# Altium schematic sheet audio_radio.SchDoc
size A4
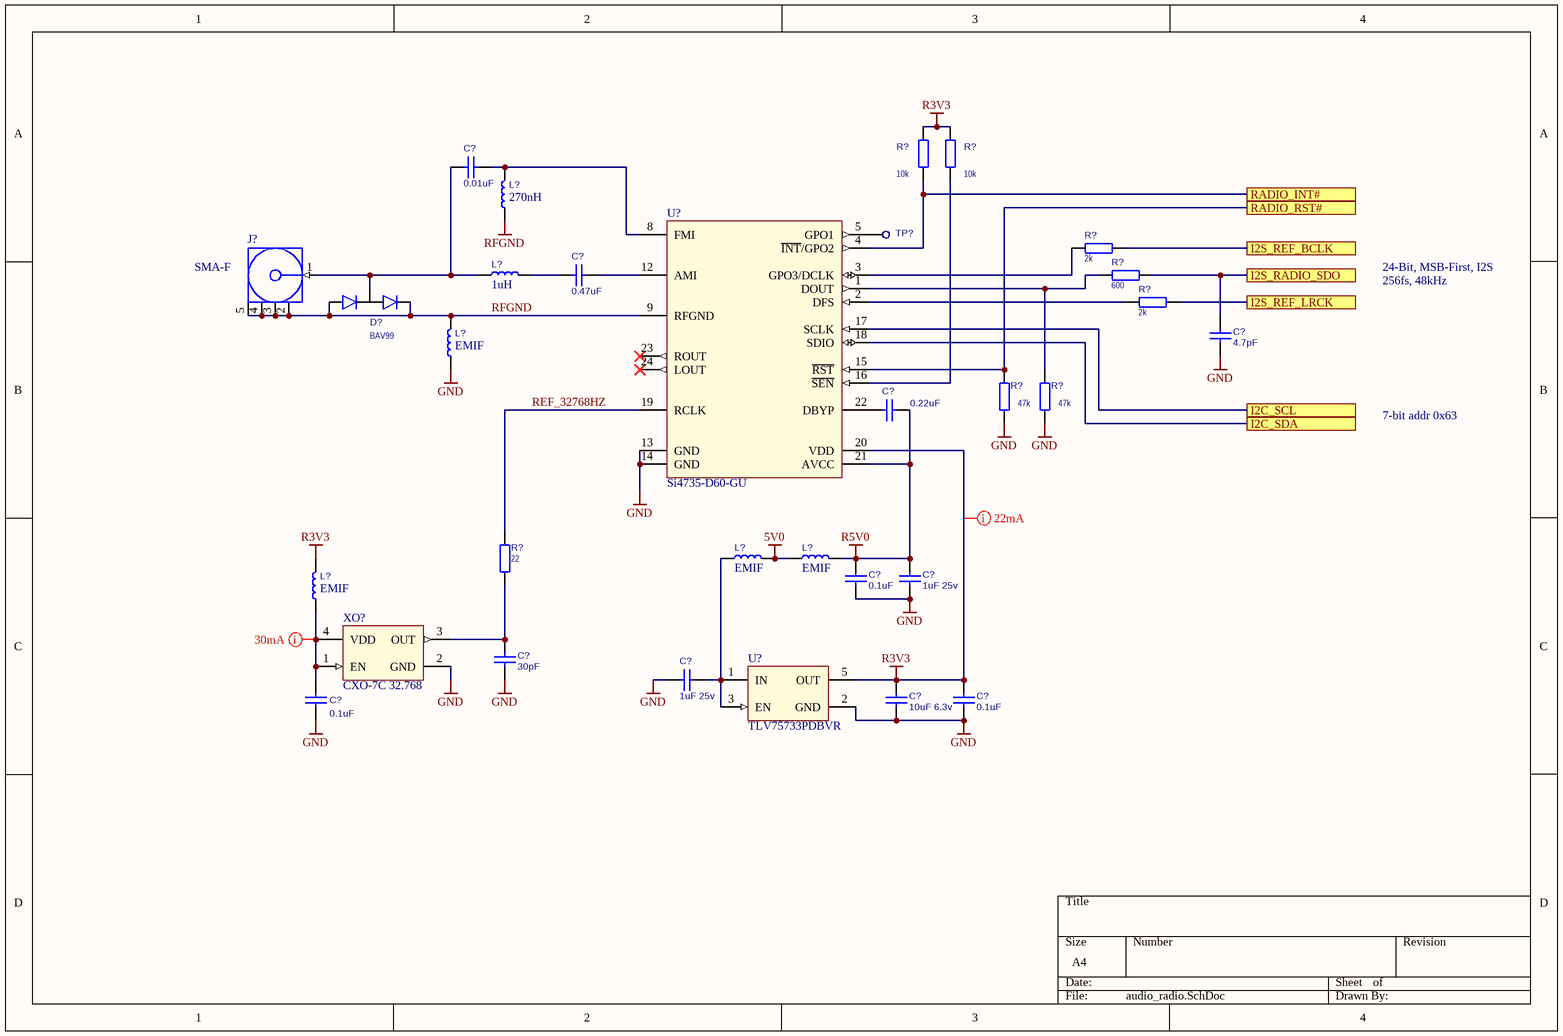
[diagram p0: audio_radio.SchDoc]

## Parts
(Parts that share a designator on the sheet are numbered #1, #2 ... from top to bottom, then left to right.)
C?#1  value 0.01uF  [C0603]  (hidden comment: CL10B103KB8NNNC)
C?#2  value 0.47uF  [C0603]  (hidden comment: CL10B474KA8NNNC)
C?#3  value 4.7pF  [C0603]  (hidden comment: CC0603CRNPO9BN4R7)
C?#4  value 0.22uF  [C0603]  (hidden comment: CC0603ZRY5V8BB224)
C?#5  value 0.1uF  [C0603]  (hidden comment: CC0603KRX7R9BB104)
C?#6  value 1uF 25v  [C0603]  (hidden comment: GRM188R61E105KA12D)
C?#7  30pF  [C0603]
C?#8  value 1uF 25v  [C0603]  (hidden comment: GRM188R61E105KA12D)
C?#9  value 0.1uF  [C0603]  (hidden comment: CC0603KRX7R9BB104)
C?#10  value 0.1uF  [C0603]  (hidden comment: CC0603KRX7R9BB104)
C?#11  value 10uF 6.3v  [C0603]  (hidden comment: CC0603MRX5R5BB106)
D?  value BAV99  [SOT-23-3]  (hidden comment: DUAL1)
J?  value SMA-F  [MCX5.08-H5]  (hidden comment: CON SMA-F S-037-TGG R/A PCB)
L?#1  value 270nH  [IND0603]  (hidden comment: LQW18ANR27J00D)
L?#2  value 1uH  [IND0603]  (hidden comment: LQM18NN2R2K00D)
L?#3  value EMIF  [IND0603]  (hidden comment: BLM18AG102SN1D)
L?#4  value EMIF  [IND0603]  (hidden comment: BLM18AG102SN1D)
L?#5  value EMIF  [IND0603]  (hidden comment: BLM18AG102SN1D)
L?#6  value EMIF  [IND0603]  (hidden comment: BLM18AG102SN1D)
R?#1  10k  [R0603]
R?#2  10k  [R0603]
R?#3  2k  [R0603]
R?#4  600  [R0603]
R?#5  2k  [R0603]
R?#6  47k  [R0603]
R?#7  47k  [R0603]
R?#8  22  [R0603]
TP?  TEST-POINT  [PAD]  (value not drawn)
U?#1  Si4735-D60-GU  [SSOP-24]
U?#2  TLV75733PDBVR  [DBV005_N]
XO?  CXO-7C 32.768  [CXO-5032]

## Ports
I2C_SCL, I2C_SDA, I2S_RADIO_SDO, I2S_REF_BCLK, I2S_REF_LRCK, RADIO_INT#, RADIO_RST#

## Nets
5V0: L?#5.1 L?#6.2
GND: C?#3.2 C?#5.2 C?#6.1 C?#7.2 C?#8.2 C?#9.2 C?#10.1 C?#11.1 L?#3.2 R?#6.2 R?#7.2 U?#1.13(GND) U?#1.14(GND) U?#2.2(GND) XO?.2(GND)
R3V3: C?#9.1 C?#11.2 L?#4.1 R?#1.2 R?#2.2 U?#1.20(VDD) U?#2.5(OUT)
R5V0: C?#4.1 C?#5.1 C?#6.2 L?#6.1 U?#1.21(AVCC)
RFGND: D?.1 D?.2 J?.2(GND) J?.3(GND) J?.4(GND) J?.5(GND) L?#1.1 L?#3.1 U?#1.9(RFGND)
I2C_SCL: U?#1.17(SCLK) ; port I2C_SCL
I2C_SDA: U?#1.18(SDIO) ; port I2C_SDA
I2S_RADIO_SDO: C?#3.1 R?#4.1 ; port I2S_RADIO_SDO
I2S_REF_BCLK: R?#3.1 ; port I2S_REF_BCLK
I2S_REF_LRCK: R?#5.1 ; port I2S_REF_LRCK
RADIO_INT#: R?#1.1 U?#1.4(~{INT}/GPO2) ; port RADIO_INT#
RADIO_RST#: R?#6.1 U?#1.15(~{RST}) ; port RADIO_RST#
REF_32768HZ: R?#8.1 U?#1.19(RCLK)
NetC?#1_1: C?#1.1 L?#1.2 U?#1.8(FMI)
NetC?#1_2: C?#1.2 D?.3 J?.1(Signal) L?#2.1
NetC?#2_1: C?#2.1 L?#2.2
NetC?#2_2: C?#2.2 U?#1.12(AMI)
NetC?#4_2: C?#4.2 U?#1.22(DBYP)
NetC?#7_1: C?#7.1 R?#8.2 XO?.3(OUT)
NetC?#8_1: C?#8.1 L?#5.2 U?#2.1(IN) U?#2.3(EN)
NetC?#10_2: C?#10.2 L?#4.2 XO?.1(EN) XO?.4(VDD)
NetR?#2_1: R?#2.1 U?#1.16(~{SEN})
NetR?#3_2: R?#3.2 U?#1.3(GPO3/DCLK)
NetR?#4_2: R?#4.2 R?#7.1 U?#1.1(DOUT)
NetR?#5_2: R?#5.2 U?#1.2(DFS)
NetTP?_1: TP?.1 U?#1.5(GPO1)

Not connected (* = marked no-connect by the designer): U?#1 23(ROUT)* 24(LOUT)*

## Layout directives
mark named 30mA: NetC?#10_2
mark named 22mA: R3V3

## Notes on the sheet
- 24-Bit, MSB-First, I2S
- 256fs, 48kHz
- 7-bit addr 0x63

## Library data of the parts
C?#1-C?#11 = CAP_NPOL
  C?#7: Value: 30pF
D? = GENERAL_DUAL_1: Dual series 1
J? = COAX-F: RF Coaxial PCB Connector, MCX; Thru-Hole, Right-Angle Mount Socket, Blunt Post Terminal, 50 Ohm Impedance; PCB_Layout: Complies with manufacturer's recommendation.; DrillSize: Corresponds to nominal value.; Published: 15-Jul-2004; LatestRevisionDate: 15-Jul-2004; LatestRevisionNote: Component Replaced.; DatasheetDocument: 30-May-2003; PackageDocument: 04-Jul-1999; PackageReference: 919-119J-51AX; Publisher: Altium Limited; ComponentLink1Description: Manufacturer Link; ComponentLink1URL: http://www.amphenolrf.com/
L?#1-L?#6 = IND_WO_IRON
R?#1-R?#8 = RESISTOR: RES
  R?#1 R?#2: Value: 10k
  R?#3 R?#5: Value: 2k
  R?#4: Value: 600
  R?#6 R?#7: Value: 47k
  R?#8: Value: 22
TP? = TEST-POINT: PCB terminal block; Value: *
U?#1 = Si473x-D60-GU: BROADCAST AM/FM/SW/LW RADIO RECEIVER; Value: Si4735-D60-GU
U?#2 = TLV733P: Capacitor-Free, 300-mA, Low-Dropout Regulator with Foldback Current Limit for Portable Devices; value: TLV75733PDBVR
XO? = CXO-7C: value: CXO-7C